# Altium schematic sheet charger.schdoc
size A
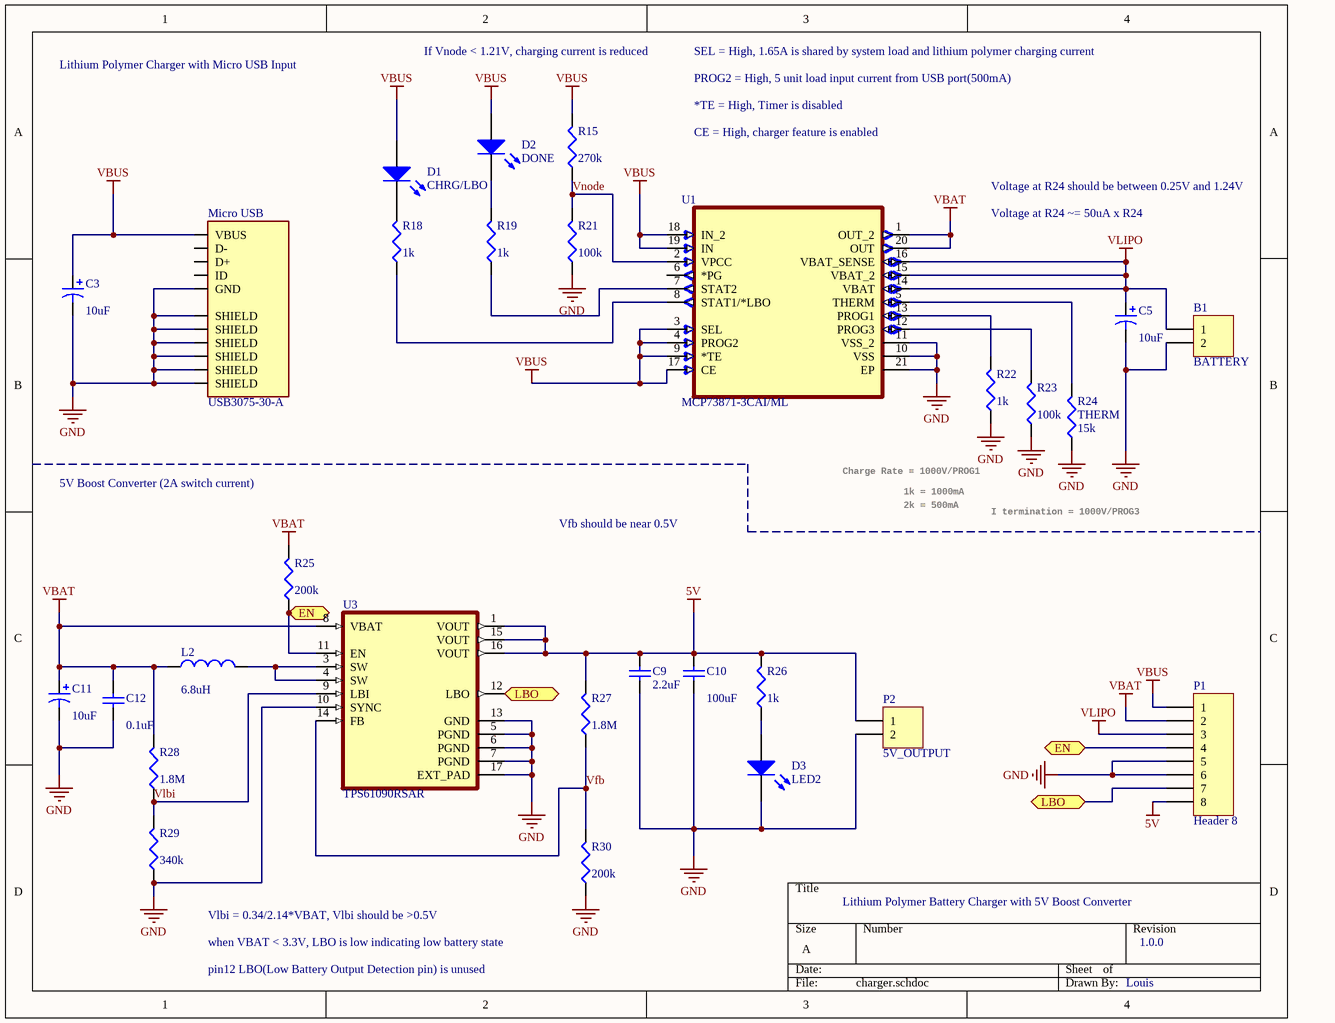
[diagram p0: charger.schdoc]

## Parts
B1  BATTERY  [HDR1X2]
C3  value 10uF  [C0805]  (hidden comment: Cap Pol3)
C5  value 10uF  [C0805]  (hidden comment: Cap Pol3)
C9  value 2.2uF  [C1206]  (hidden comment: Cap Semi)
C10  value 100uF  [C1206]  (hidden comment: Cap Semi)
C11  value 10uF  [C0805]  (hidden comment: Cap Pol3)
C12  0.1uF  [1608[0603]]
D1  CHRG/LBO  [3.2X1.6X1.1]
D2  DONE  [3.2X1.6X1.1]
D3  LED2  [3.2X1.6X1.1]
L2  6.8uH  [6.8uH inductor]
Micro_USB  USB3075-30-A  [GCT_USB3075-30-A]
P1  Header 8  [HDR1X8]
P2  5V_OUTPUT  [HDR1X2]
R15  270k  [J1-0603]
R18  value 1k  [J1-0603]  (hidden comment: Res3)
R19  value 1k  [J1-0603]  (hidden comment: Res3)
R21  100k  [J1-0603]
R22  1k  [J1-0603]
R23  value 100k  [J1-0603]  (hidden comment: Res3)
R24  THERM  value 15k  [J1-0603]
R25  200k  [J1-0603]
R26  value 1k  [J1-0603]  (hidden comment: Res3)
R27  value 1.8M  [J1-0603]  (hidden comment: Res3)
R28  value 1.8M  [J1-0603]  (hidden comment: Res3)
R29  value 340k  [J1-0603]  (hidden comment: Res3)
R30  value 200k  [J1-0603]  (hidden comment: Res3)
U1  MCP73871-3CAI/ML  [QFN50P400X400X100-21N]
U3  TPS61090RSAR  [QFN65P400X400X100-17N]

## Ports
EN, LBO

## Nets
5V: C9.2 C10.2 P1.8 P2.1 R26.2 R27.2 U3.1(VOUT) U3.15(VOUT) U3.16(VOUT)
GND: B1.2 C3.2 C5.2 C9.1 C10.1 C11.2 C12.1 D3.2(K) Micro_USB.5(GND) Micro_USB.S1(SHIELD) Micro_USB.S2(SHIELD) Micro_USB.S3(SHIELD) Micro_USB.S4(SHIELD) Micro_USB.S5(SHIELD) Micro_USB.S6(SHIELD) P1.5 P1.6 P2.2 R21.1 R22.1 R23.1 R24.1 R29.1 R30.1 U1.10(VSS) U1.11(VSS_2) U1.21(EP) U3.5(PGND) U3.6(PGND) U3.7(PGND) U3.10(SYNC) U3.13(GND) U3.17(EXT_PAD)
VBAT: C11.1 C12.2 L2.1 P1.2 R25.2 R28.2 U1.1(OUT_2) U1.20(OUT) U3.8(VBAT)
VBUS: C3.1 D1.1(A) D2.1(A) Micro_USB.1(VBUS) P1.1 R15.2 U1.3(SEL) U1.4(PROG2) U1.9(*TE) U1.17(CE) U1.18(IN_2) U1.19(IN)
VLIPO: B1.1 C5.1 P1.3 U1.14(VBAT) U1.15(VBAT_2) U1.16(VBAT_SENSE)
EN: P1.4 R25.1 U3.11(EN) ; port EN
LBO: P1.7 U3.12(LBO) ; port LBO
Vfb: R27.1 R30.2 U3.14(FB)
Vlbi: R28.1 R29.2 U3.9(LBI)
Vnode: R15.1 R21.2 U1.2(VPCC)
NetD1_2: D1.2(K) R18.2
NetD2_2: D2.2(K) R19.2
NetD3_1: D3.1(A) R26.1
NetL2_2: L2.2 U3.3(SW) U3.4(SW)
NetR18_1: R18.1 U1.8(STAT1/*LBO)
NetR19_1: R19.1 U1.7(STAT2)
NetR22_2: R22.2 U1.13(PROG1)
NetR23_2: R23.2 U1.12(PROG3)
NetR24_2: R24.2 U1.5(THERM)

Not connected (* = marked no-connect by the designer): Micro_USB 2(D-) 3(D+) 4(ID); U1 6(*PG)

## Notes on the sheet
- Lithium Polymer Charger with Micro USB Input
- If Vnode < 1.21V, charging current is reduced
- SEL = High, 1.65A is shared by system load and lithium polymer charging current
- PROG2 = High, 5 unit load input current from USB port(500mA)
- *TE = High, Timer is disabled
- CE = High, charger feature is enabled
- Voltage at R24 should be between 0.25V and 1.24V
- Voltage at R24 ~= 50uA x R24
- 5V Boost Converter (2A switch current)
- Charge Rate = 1000V/PROG1
- 1k = 1000mA
- 2k = 500mA
- Vfb should be near 0.5V
- I termination = 1000V/PROG3
- Lithium Polymer Battery Charger with 5V Boost Converter
- pin12 LBO(Low Battery Output Detection pin) is unused
- Vlbi = 0.34/2.14*VBAT, Vlbi should be >0.5V
- when VBAT < 3.3V, LBO is low indicating low battery state
- 1.0.0
- Louis

## Library data of the parts
B1 P2 = Header 2: Header, 2-Pin; LatestRevisionDate: 17-Jul-2002; LatestRevisionNote: Re-released for DXP Platform.; Publisher: Altium Limited
C3 C5 C11 = Cap Pol3: Polarized Capacitor (Surface Mount); Published: 8-Jun-2000; LatestRevisionDate: 29-May-2009; LatestRevisionNote: IPC-7351 Footprint Added.; PackageReference: C0805; Publisher: Altium Limited; PackageDescription: Chip Capacitor
C9 C12 = Cap Semi: Capacitor (Semiconductor SIM Model); Published: 8-Jun-2000; LatestRevisionDate: 29-May-2009; LatestRevisionNote: IPC-7351 Footprint Added.; PackageReference: C1206; Publisher: Altium Limited; PackageDescription: Chip Capacitor
  C12: Value: 0.1uF
C10 = Cap Semi: Capacitor (Semiconductor SIM Model); Manufacturer Part #: TL8A0107M6R3C; Published: 8-Jun-2000; LatestRevisionDate: 29-May-2009; LatestRevisionNote: IPC-7351 Footprint Added.; PackageReference: C1206; Publisher: Altium Limited; PackageDescription: Chip Capacitor
D1-D3 = LED2: Typical RED, GREEN, YELLOW, AMBER GaAs LED; Published: 8-Jun-2000; LatestRevisionDate: 17-Jul-2002; LatestRevisionNote: Re-released for DXP Platform.; PackageVersion: Feb-2002; PackageReference: 3.2X1.6X1.1; Publisher: Altium Limited; PackageDescription: SM LED; 2 Flat Leads
L2 = Inductor: Manufacturer Part #: VLS6045EX-6R8M-H; Code_IEC: 1005; Published: 8-Jun-2000; LatestRevisionDate: 29-May-2009; LatestRevisionNote: IPC-7351 Footprint Added.; PackageReference: 0402-A; Publisher: Altium Limited; PackageDescription: Chip Inductor; Code_JEITA: 0402; Value: 6.8uH
Micro_USB = USB3075-30-A: USB - micro B USB 2.0 Receptacle Connector 5 Position Surface Mount, Right Angle; Through Hole; MF: Global Connector Technology; SnapEDA_Link: https://www.snapeda.com/parts/USB3075-30-A/Global%20Connector%20Technology/view-part/229370/?ref=snap; Value: *; Digi-Key_Part_Number: 2073-USB3075-30-ACT-ND; MP: USB3075-30-A; Digi-Key_Purchase_URL: https://www.digikey.com/product-detail/en/gct/USB3075-30-A/2073-USB3075-30-ACT-ND/9859705?utm_source=snapeda&utm_medium=aggregator&utm_campaign=symbol; Package: None
P1 = Header 8: Header, 8-Pin; LatestRevisionDate: 17-Jul-2002; LatestRevisionNote: Re-released for DXP Platform.; Publisher: Altium Limited
R15 R18 R19 R21-R30 = Res3: Resistor; Published: 8-Jun-2000; LatestRevisionDate: 29-May-2009; LatestRevisionNote: IPC-7351 Footprint Added.; PackageReference: J1-0603; Publisher: Altium Limited; PackageDescription: Chip Resistor
  R15: Value: 270k
  R21: Value: 100k
  R22: Value: 1k
  R25: Value: 200k
U1 = MCP73871-3CAI/ML: Charger IC Lithium Ion/Polymer 20-QFN _4x4_; MF: Microchip; Package: QFN-20 Microchip; MP: MCP73871-3CAI/ML; Value: *; Availability: Unavailable; SnapEDA_Link: https://www.snapeda.com/parts/MCP73871-3CAI/ML/Microchip/view-part/1049918/?ref=snap; Price: None
U3 = TPS61090RSAR: 1.8Vin, 2A Switch, 96% Efficient Boost Converter 16-QFN -40 to 85; MF: Texas Instruments; SnapEDA_Link: https://www.snapeda.com/parts/TPS61090RSAR/Texas%20Instruments/view-part/51689/?ref=snap; Availability: Good; Price: None; Package: VQFN-16 Texas Instruments; Purchase-URL: https://pricing.snapeda.com/search/part/TPS61090RSAR/?ref=eda; Check_prices: https://www.snapeda.com/parts/TPS61090RSAR/Texas%20Instruments/view-part/51689/?ref=eda; Value: *; MP: TPS61090RSAR